# EAGLE design main_board (EAGLE 7.3.0)
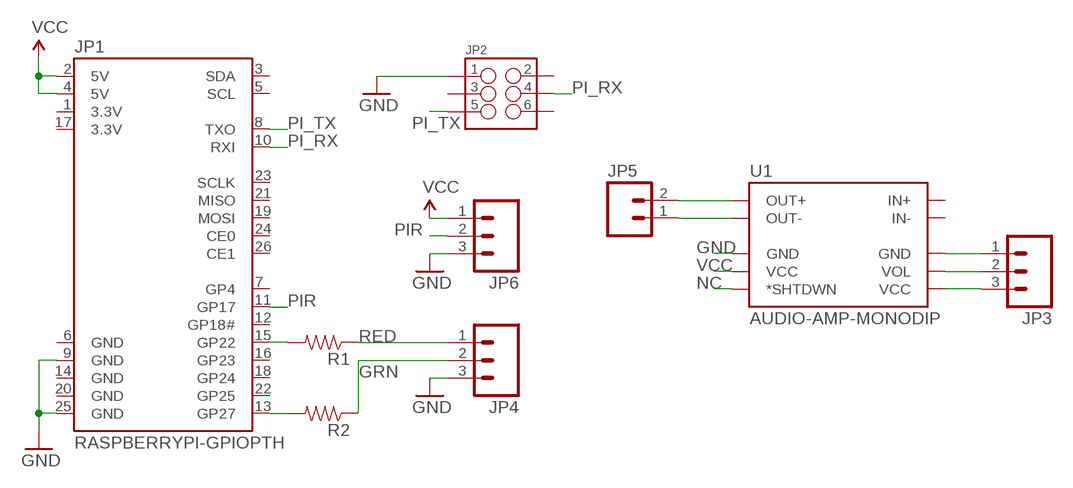
[diagram p0: schematic, sheet 1]

## Parts
JP1  RASPBERRYPI-GPIOPTH  [2X13-SHROUDED]
JP2  M03X2SHROUD  [2X3-SHROUDED]
JP3  M03PTH  [1X03]
JP4  M03PTH  [1X03]
JP5  M021X02_NO_SILK  [1X02_NO_SILK]
JP6  M03PTH  [1X03]
R1  RESISTORPTH-1/4W  [AXIAL-0.4]
R2  RESISTORPTH-1/4W  [AXIAL-0.4]
U1  AUDIO-AMP-MONODIP  [AUDIO-AMP-MONO]

## Nets
GND: JP1.9(GND) JP1.25(GND) JP2.1 JP4.3 JP6.3 U1.PWR-(GND)
GRN: JP4.2 R2.P$1
N$1: JP5.2 U1.OUT+
N$2: JP5.1 U1.OUT-
N$3: JP1.15(GP22) R1.P$2
N$5: JP1.13(GP27) R2.P$2
N$7: JP3.1 U1.VOL-(GND)
N$8: JP3.2 U1.VOL
N$9: JP3.3 U1.VOL+(VCC)
NC: U1.S(*SHTDWN)
PI_RX: JP1.10(RXI) JP2.4
PI_TX: JP1.8(TXO) JP2.5
PIR: JP1.11(GP17) JP6.2
RED: JP4.1 R1.P$1
VCC: JP1.2(5V) JP1.4(5V) JP6.1 U1.PWR+(VCC)
Unconnected: JP1.3(SDA) JP1.5(SCL) JP1.7(GP4) JP1.12(GP18#) JP1.16(GP23) JP1.18(GP24) JP1.19(MOSI) JP1.21(MISO) JP1.22(GP25) JP1.23(SCLK) JP1.24(CE0) JP1.26(CE1) JP2.2 JP2.3 JP2.6 U1.IN+ U1.IN-

## Power pins joined to a net without a drawn wire
3.3V: JP1.1(3.3V) JP1.17(3.3V)
GND: JP1.6(GND) JP1.14(GND) JP1.20(GND)

## Library data of the parts
JP1 = SparkFun-Boards:RASPBERRYPI-GPIO: RASPBERRY PI I/O HEADER As defined for the Revistion 2 Pi.; DIST: sparkfun; DIST_ID: PRT-11490
JP2 = SparkFun-Connectors:M03X2: 2x3 .1" header. Shrouded, with keying- CONN-10681 SMT- CONN-11415 Pogo pins- HW-11044; PROD_ID: CONN-10681
JP3 JP4 JP6 = SparkFun-Connectors:M03: Header 3 Standard 3-pin 0.1" header. Use with straight break away headers (SKU : PRT-00116), right angle break away headers (PRT-00553), swiss pins (PRT-00743), machine pins (PRT-00117), and female headers (PRT-00115). Molex polarized connector foot print use with SKU : PRT-08232 with associated crimp pins and housings.
JP5 = SparkFun-Connectors:M02: Standard 2-pin 0.1" header. Use with - straight break away headers ( PRT-00116) - right angle break away headers (PRT-00553) - swiss pins (PRT-00743) - machine pins (PRT-00117) - female headers (PRT-00115) Molex polarized connector foot print use with: PRT-08233 with associated crimp pins and housings. 2.54_SCREWTERM for use with PRT-10571. 3.5mm Screw Terminal footprints for PRT-08084 5mm Screw Terminal footprints for use with PRT-08432
R1 R2 = SparkFun-Resistors:RESISTOR: Resistor Basic schematic elements and footprints for 0603, 1206, and PTH resistors.
U1 = SparkFun-Boards:AUDIO-AMP-MONO

## Board
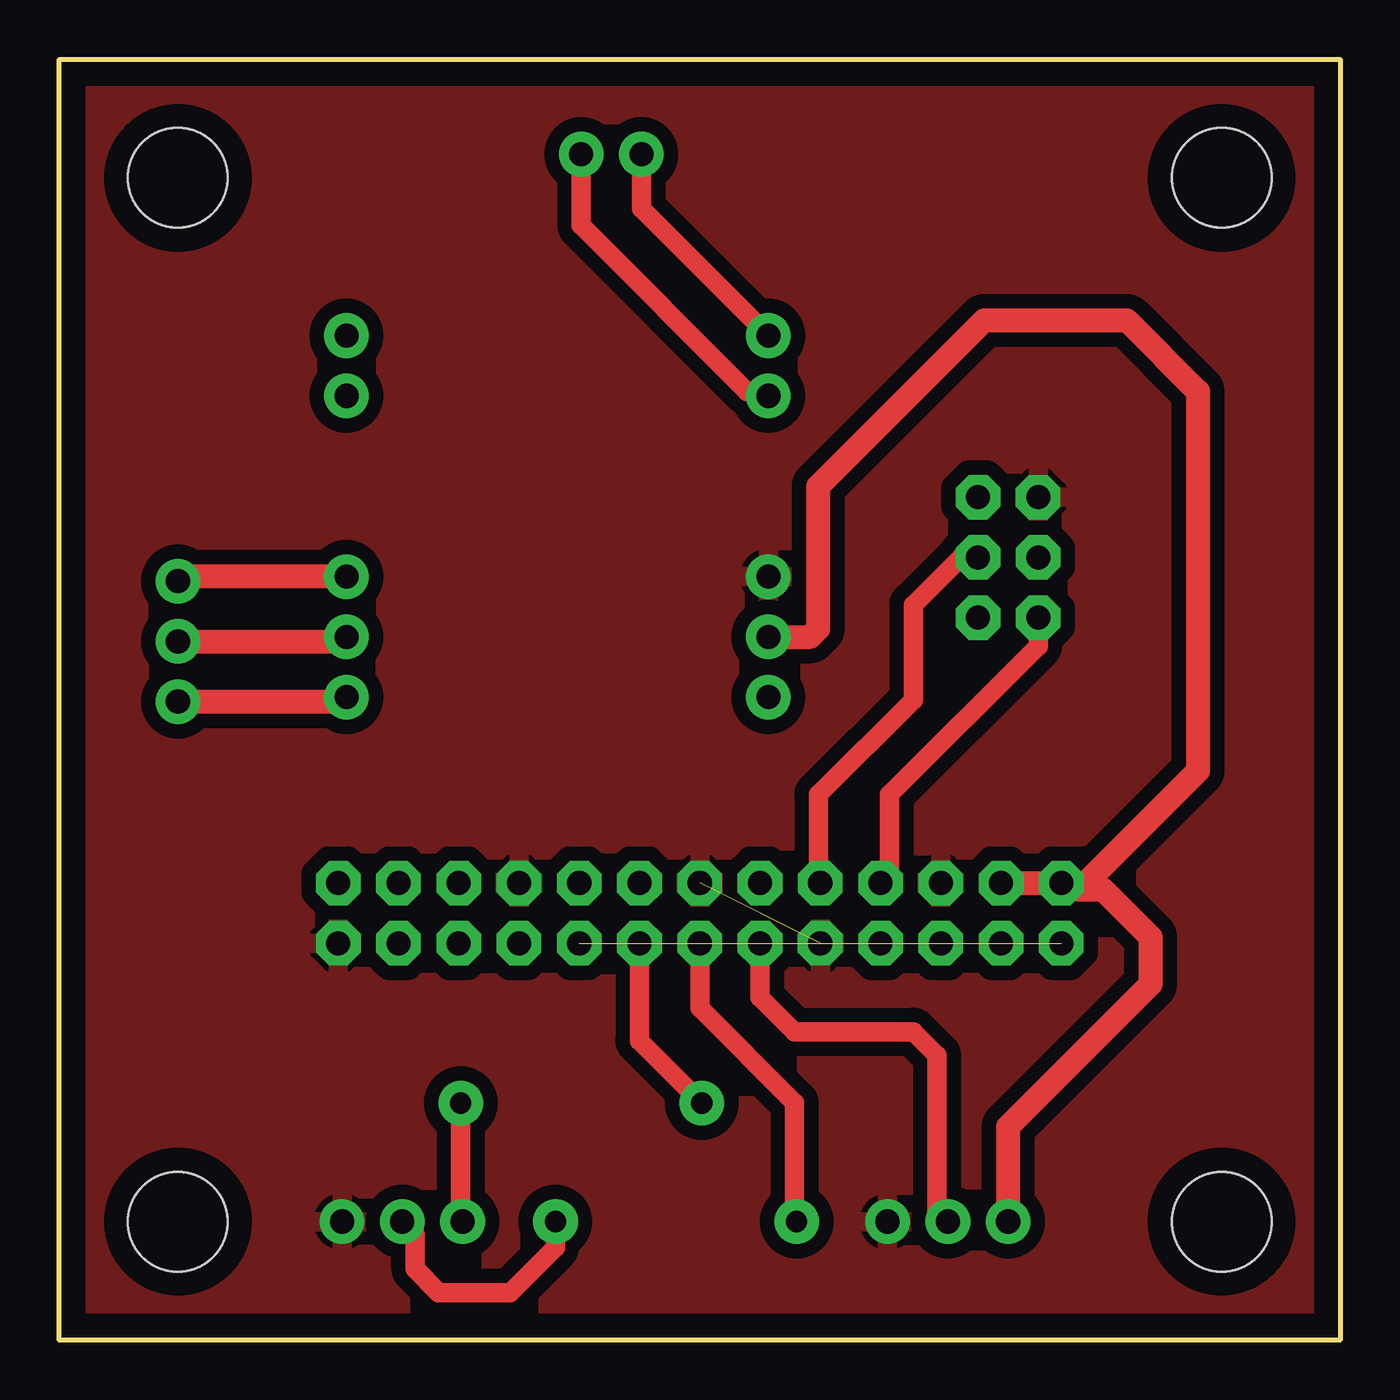
[diagram p1: board, top side]
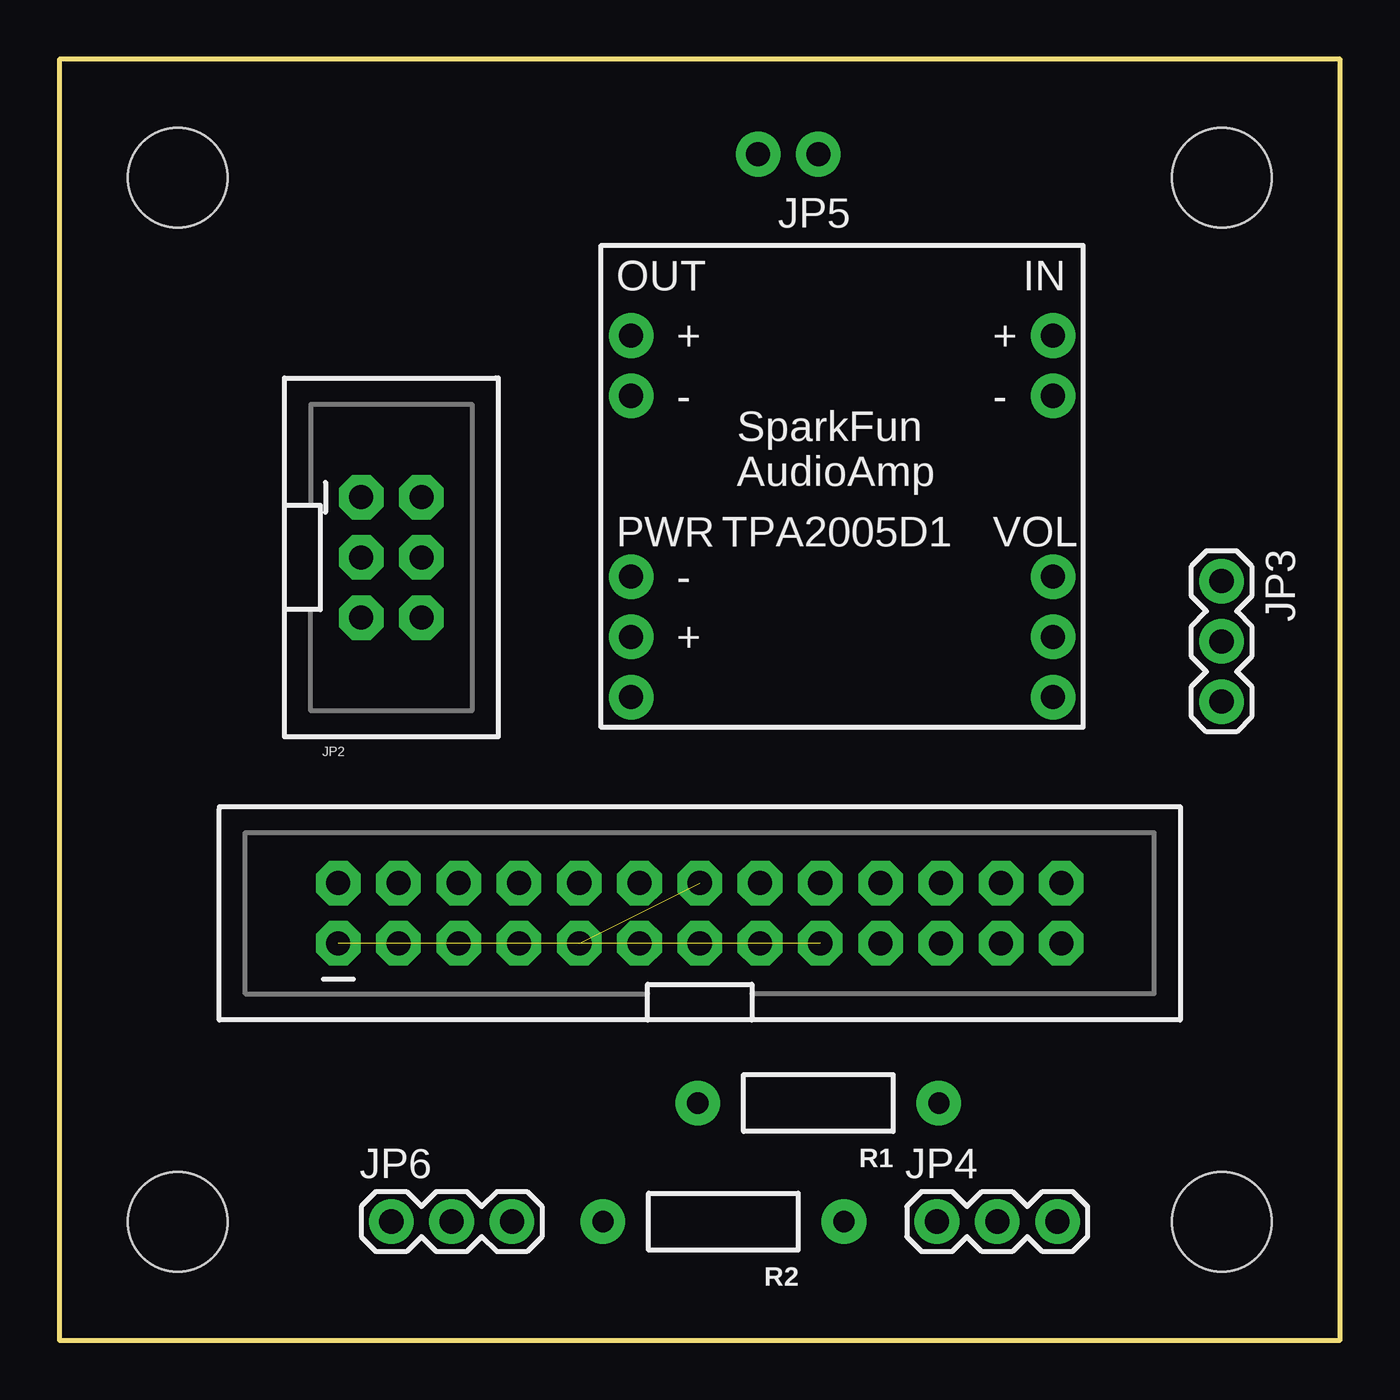
[diagram p2: board, bottom side, seen from below]

Size 54 x 54 mm. Coordinates in mm from the lower left corner, seen from the top.
Outline: 0,0 0,54 54,54 54,0 0,0
Copper layers (1*16): Top 0.035mm / dielectric 1.5mm / Bottom 0.035mm
Design rules "default": minimum track width 10mil, minimum drill 24mil, track to track 8mil, track to pad 8mil, pad to pad 8mil, via to via 8mil, smd to smd 8mil, copper to edge 40mil, drill to drill 8mil, minimum pad ring 10mil, minimum via ring 8mil, stop-mask expansion 4mil, vias tented up to drill 0mil, thermal gap 10mil
Holes 4.2 mm at 5,5 49,5 49,49 5,49

### Footprints (pad centres in the part's own frame; a part is rotated, then mirrored left to right if it is on the bottom)
2X13-SHROUDED = drill 1.016 pad 1.88 octagon: 1 -1.27,15.24; 2 1.27,15.24; 3 -1.27,12.7; 4 1.27,12.7; 5 -1.27,10.16; 6 1.27,10.16; 7 -1.27,7.62; 8 1.27,7.62; 9 -1.27,5.08; 10 1.27,5.08; 11 -1.27,2.54; 12 1.27,2.54; 13 -1.27,0; 14 1.27,0; 15 -1.27,-2.54; 16 1.27,-2.54; 17 -1.27,-5.08; 18 1.27,-5.08; 19 -1.27,-7.62; 20 1.27,-7.62; 21 -1.27,-10.16; 22 1.27,-10.16; 23 -1.27,-12.7; 24 1.27,-12.7; 25 -1.27,-15.24; 26 1.27,-15.24
2X3-SHROUDED = drill 1.016 pad 1.88 octagon: 1 -1.27,2.54; 2 1.27,2.54; 3 -1.27,0; 4 1.27,0; 5 -1.27,-2.54; 6 1.27,-2.54
1X03 = drill 1.016 pad 1.88: 1 0,0; 2 2.54,0; 3 5.08,0
1X02_NO_SILK = drill 1.016 pad 1.88: 1 0,0; 2 2.54,0
AXIAL-0.4 = drill 0.9 pad 1.88: P$1 -5.08,0; P$2 5.08,0
AUDIO-AMP-MONO = drill 1.016 pad 1.88: IN+ 8.89,6.35; IN- 8.89,3.81; OUT+ -8.89,6.35; OUT- -8.89,3.81; PWR+ -8.89,-6.35; PWR- -8.89,-3.81; S -8.89,-8.89; VOL 8.89,-6.35; VOL+ 8.89,-8.89; VOL- 8.89,-3.81

### Placement (x,y rotation side)
JP1  27,18 90 bottom
JP2  40,33 0 bottom
JP3  5,32 270 bottom
JP4  17,5 0 bottom
JP5  22,50 180 bottom
JP6  40,5 0 bottom
R1  22,10 180 bottom
R2  26,5 180 bottom
U1  21,36 0 bottom

### Tracks (layer width: path | path; a pad name or v marks a point on that pad's centre or on a via)
3.3V  (1 unrouted)
GND  (1 unrouted)
  pour Top (isolate 0.61): 0,54 54,54 54,0 0,0
GRN
  Top 0.813: R2.P$1 20.92,3.92 19,2 16,2 15,3 15,4.46 JP4.2
N$1
  Top 0.813: JP5.2 24.54,47.7 U1.OUT+
N$2
  Top 0.813: JP5.1 22,47 29,40 29.7,40 U1.OUT-
N$3
  Top 0.813: JP1.15 24.46,12.62 R1.P$2
N$5
  Top 0.813: JP1.13 27,14 31,10 31,5.08 R2.P$2
N$7
  Top 1.016: U1.VOL- 5.19,32.19 JP3.1
N$8
  Top 1.016: JP3.2 11.92,29.46 U1.VOL
N$9
  Top 1.016: JP3.3 11.92,26.92 U1.VOL+
PI_RX
  Top 0.813: JP2.4 38,33 36,31 36,27 32,23 32,19.35 JP1.10
PI_TX
  Top 0.813: JP2.5 41.27,29.27 35,23 35,19.65 JP1.8
PIR
  Top 0.813: JP1.11 29.54,14.46 31,13 36,13 37,12 37,5.46 JP6.2
RED
  Top 0.813: R1.P$1 16.92,5.08 JP4.1
VCC
  Top 1.016: JP1.4 JP1.2 42.51,19 43,19 | U1.PWR+ 31.65,29.65 32,30 32,36 39,43 45,43 48,40 48,24 43,19 | 43,19 44,19 46,17 46,15 40,9 JP6.1